# Altium schematic sheet Telemetry, I2C.SchDoc
size A; DocumentNumber: 8; SheetNumber: 8; SheetTotal: 16
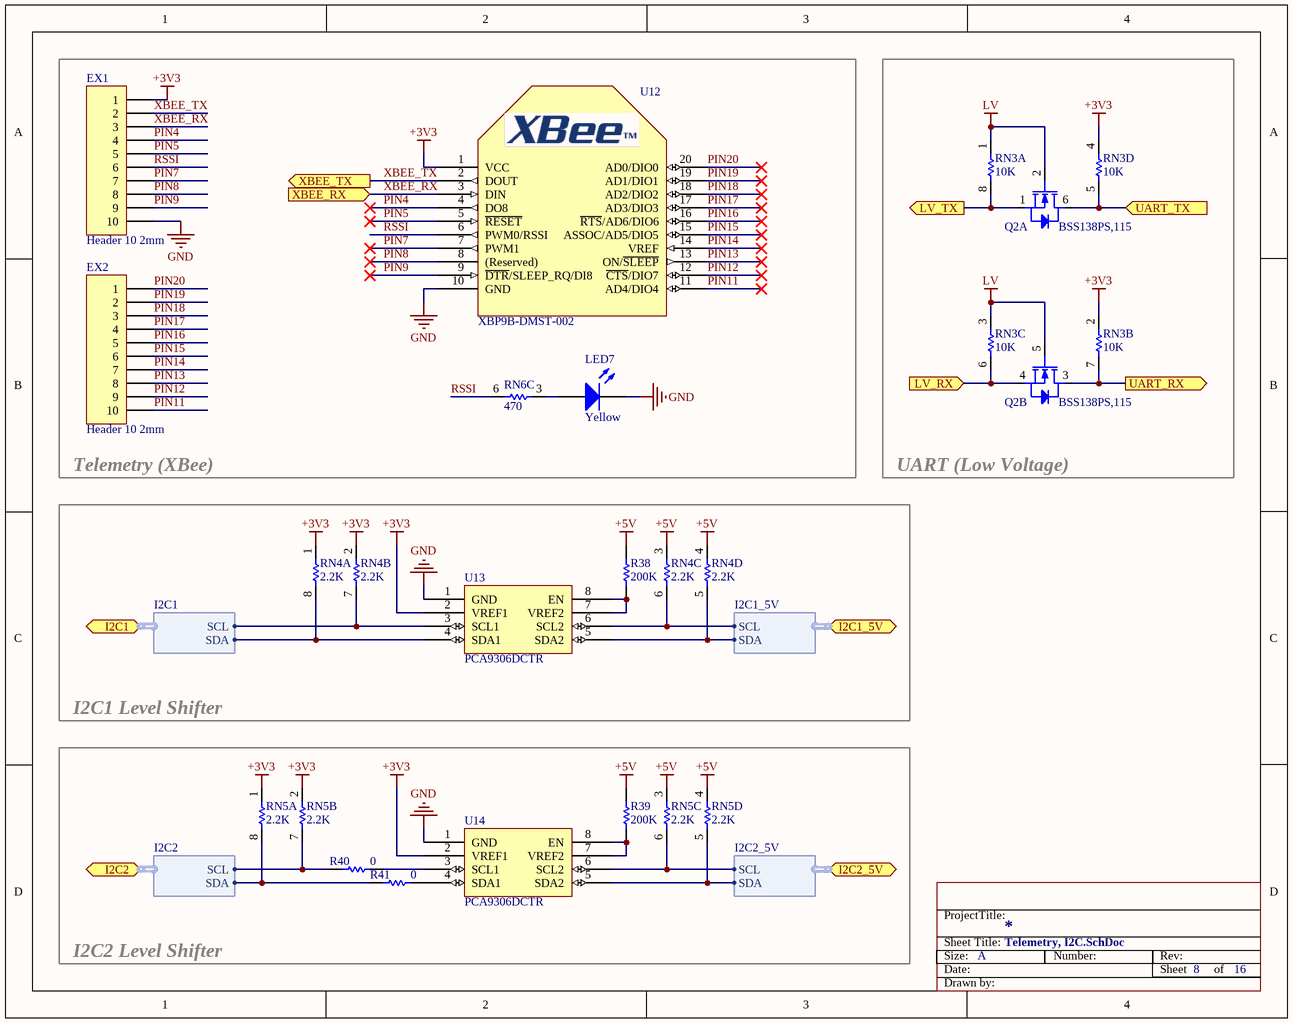
[diagram p0: Telemetry, I2C.SchDoc]

## Parts
EX1  Header 10 2mm  [2mm pitch female header]
EX2  Header 10 2mm  [2mm pitch female header]
LED7  Color: Yellow  [LED_0603[1608M]]  (hidden comment: LED)
Q2  Manufacturer Part Number: BSS138PS,115  [SOT363-6]  (hidden comment: N-CH MOSFET-D-ARRAY)  (parts A,B of 2)
R38  value 200K  [RES_0402[1005M]]  (hidden comment: RES)
R39  value 200K  [RES_0402[1005M]]  (hidden comment: RES)
R40  value 0  [JUMPER_RES_0402]  (hidden comment: RES)
R41  value 0  [JUMPER_RES_0402]  (hidden comment: RES)
RN3  value 10K  [RES ARRAY SMD]  (hidden comment: Res Network 1)  (parts A,B,C,D of 4)
RN4  value 2.2K  [RES ARRAY SMD]  (hidden comment: Res Network 1)  (parts A,B,C,D of 4)
RN5  value 2.2K  [RES ARRAY SMD]  (hidden comment: Res Network 1)  (parts A,B,C,D of 4)
RN6  value 470  [RES ARRAY SMD]  (hidden comment: Res Network 1)  (part C of 4)
U12  Manufacturer Part Number: XBP9B-DMST-002  [XBee PRO for headers]  (hidden comment: XBee / XBee PRO)
U13  Manufacturer Part Number: PCA9306DCTR  [DCT-8 (LSSOP-8)]  (hidden comment: PCA9306DC)
U14  Manufacturer Part Number: PCA9306DCTR  [DCT-8 (LSSOP-8)]  (hidden comment: PCA9306DC)

## Blocks framed on the sheet
Telemetry (XBee): EX1 EX2 LED7 RN6 U12
UART (Low Voltage): Q2 RN3
I2C1 Level Shifter: R38 RN4 U13
I2C2 Level Shifter: R39-R41 RN5 U14

## Ports
I2C1 (harness I2C1), I2C1_5V (harness I2C1_5V), I2C2 (harness I2C2), I2C2_5V (harness I2C2_5V), LV_RX (in), LV_TX (out), UART_RX (out), UART_TX (in), XBEE_RX (in), XBEE_TX (out)

## Harnesses
I2C1: SDA, SCL
I2C2: SDA, SCL
I2C1_5V: SDA, SCL
I2C2_5V: SDA, SCL

## Nets
+3V3: EX1.1 RN3.2 RN3.4 RN4.1 RN4.2 RN5.1 RN5.2 U12.1(VCC) U13.2(VREF1) U14.2(VREF1)
+5V: R38.1 R39.1 RN4.3 RN4.4 RN5.3 RN5.4
GND: EX1.10 LED7.2(K) U12.10(GND) U13.1(GND) U14.1(GND)
LV: Q2.2(G1) Q2.5(G2) RN3.1 RN3.3
LV_RX: Q2.4(S2) RN3.6 ; port LV_RX
LV_TX: Q2.1(S1) RN3.8 ; port LV_TX
PIN4: EX1.4 U12.4(DO8)
PIN5: EX1.5 U12.5(~{RESET})
PIN7: EX1.7 U12.7(PWM1)
PIN8: EX1.8 U12.8((Reserved))
PIN9: EX1.9 U12.9(~{DTR}/SLEEP_RQ/DI8)
PIN11: EX2.10 U12.11(AD4/DIO4)
PIN12: EX2.9 U12.12(~{CTS}/DIO7)
PIN13: EX2.8 U12.13(ON/~{SLEEP})
PIN14: EX2.7 U12.14(VREF)
PIN15: EX2.6 U12.15(ASSOC/AD5/DIO5)
PIN16: EX2.5 U12.16(~{RTS}/AD6/DIO6)
PIN17: EX2.4 U12.17(AD3/DIO3)
PIN18: EX2.3 U12.18(AD2/DIO2)
PIN19: EX2.2 U12.19(AD1/DIO1)
PIN20: EX2.1 U12.20(AD0/DIO0)
RSSI: EX1.6 RN6.6 U12.6(PWM0/RSSI)
UART_RX: Q2.3(D1) RN3.7 ; port UART_RX
UART_TX: Q2.6(D1) RN3.5 ; port UART_TX
XBEE_RX: EX1.3 U12.3(DIN) ; port XBEE_RX
XBEE_TX: EX1.2 U12.2(DOUT) ; port XBEE_TX
NetLED7_1: LED7.1(A) RN6.3
NetR38_2: R38.2 U13.7(VREF2) U13.8(EN)
NetR39_2: R39.2 U14.7(VREF2) U14.8(EN)
NetR40_1: R40.1 U14.3(SCL1)
NetR40_2: R40.2 RN5.7 ; port I2C2.SCL
NetR41_1: R41.1 U14.4(SDA1)
NetR41_2: R41.2 RN5.8 ; port I2C2.SDA
NetRN4_5: RN4.5 U13.5(SDA2) ; port I2C1_5V.SDA
NetRN4_6: RN4.6 U13.6(SCL2) ; port I2C1_5V.SCL
NetRN4_7: RN4.7 U13.3(SCL1) ; port I2C1.SCL
NetRN4_8: RN4.8 U13.4(SDA1) ; port I2C1.SDA
NetRN5_5: RN5.5 U14.5(SDA2) ; port I2C2_5V.SDA
NetRN5_6: RN5.6 U14.6(SCL2) ; port I2C2_5V.SCL

## Notes on the sheet
- Sheet Title:
- ProjectTitle:
- Size:
- Date:
- A
- Number:
- Rev:
- Sheet         of
- Drawn by:

## Library data of the parts
EX1 EX2 = Header 10: Header, 10-Pin; Manufacturer: Sullins Connector Solutions; Manufacturer Part Number: NPPN101BFCN-RC; ComponentLink1Description: Datasheet; ComponentLink1URL: http://www.sullinscorp.com/drawings/75_1BFC_10483.pdf; Supplier 1: Digi-Key; Supplier Part Number 1: S5751-10-ND
LED7 = LED: LED YELLOW CLEAR 0603 SMD; Manufacturer: Lite-On Inc.; Manufacturer Part Number: LTST-C190YKT; Supplier 1: Digi-Key; Supplier Part Number 1: 160-1184-1-ND; ComponentLink1URL: http://media.digikey.com/pdf/Data%20Sheets/Lite-On%20PDFs/LTST-C190YKT.pdf; ComponentLink1Description: Datasheet
Q2 = N-CH MOSFET-D-ARRAY: N-CH MOSFET W/ DIODE DUAL PACKAGE; Manufacturer: NXP Semiconductors; Vgs(th) (Max) @ Id: 1.5V @ 250µA; Current - Continuous Drain (Id) @ 25°C: 320mA; Power - Max: 420mW; Input Capacitance (Ciss) @ Vds: 50pF @ 10V; Gate Charge (Qg) @ Vgs: 0.8nC @ 4.5V; Rds On (Max) @ Id, Vgs: 1.6 Ohm @ 300mA, 10V; Drain to Source Voltage (Vdss): 60V; Supplier 1: Digi-Key; Supplier Part Number 1: 568-8393-1-ND; ComponentLink1URL: http://www.nxp.com/documents/data_sheet/BSS138PS.pdf; ComponentLink1Description: Datasheet
R38 R39 = RES: Resistor; Manufacturer: Yageo; Manufacturer Part Number: RC0402FR-07200KL; ComponentLink1URL: http://www.yageo.com/NewPortal/yageodocoutput?fileName=/pdf/R-Chip/PYu-RC_Group_51_RoHS_L_3.pdf; ComponentLink1Description: Datasheet; Supplier 1: Digi-Key; Supplier Part Number 1: 311-200KLRCT-ND
R40 R41 = RES: Resistor; Manufacturer Part Number: RC0402JR-070RL; Manufacturer: Yageo; Supplier 1: Digi-Key; Supplier Part Number 1: 311-0.0JRCT-ND; ComponentLink1URL: http://www.yageo.com/NewPortal/yageodocoutput?fileName=/pdf/R-Chip/PYu-RC_Group_51_RoHS_L_3.pdf; ComponentLink1Description: Datasheet
RN3 = Res Network 1: Isolated Resistor Network; Manufacturer Part Number: YC164-JR-0710KL; Manufacturer: Yageo; Supplier 1: Digi-Key; Supplier Part Number 1: YC164J-10KCT-ND; ComponentLink1URL: http://www.yageo.com/NewPortal/yageodocoutput?fileName=/pdf/R-Chip/PYu-YC_TC_group_51_RoHS_L_0.pdf; ComponentLink1Description: Datasheet
RN4 RN5 = Res Network 1: Isolated Resistor Network; Manufacturer Part Number: YC164-JR-072K2L; Manufacturer: Yageo; Supplier 1: Digi-Key; Supplier Part Number 1: YC164J-2.2KCT-ND; ComponentLink1URL: http://www.yageo.com/NewPortal/yageodocoutput?fileName=/pdf/R-Chip/PYu-YC_TC_group_51_RoHS_L_0.pdf; ComponentLink1Description: Datasheet
RN6 = Res Network 1: Isolated Resistor Network; Manufacturer: Yageo; Manufacturer Part Number: YC164-JR-07470RL; Supplier 1: Digi-Key; Supplier Part Number 1: YC164J-470CT-ND; ComponentLink1URL: http://www.yageo.com/NewPortal/yageodocoutput?fileName=/pdf/R-Chip/PYu-YC_TC_group_51_RoHS_L_0.pdf; ComponentLink1Description: Datasheet
U12 = XBee / XBee PRO: MODULE XBEE PRO S3B 900HP RPSMA; Manufacturer: Digi International; Current - Receiving: 29mA; Current - Transmitting: 215mA; Data Rate: 200Kbps; Modulation: FHSS; Frequency: 900MHz; Supplier 1: Digi-Key; Supplier Part Number 1: 602-1299-ND; ComponentLink1Description: Datasheet; ComponentLink1URL: https://www.google.ca/url?sa=t&rct=j&q=&esrc=s&source=web&cd=6&cad=rja&uact=8&ved=0CEYQFjAFahUKEwiKwrH8s-PIAhVNOIgKHaDJAYA&url=http%3A%2F%2Fwww.mouser.com%2Fpdfdocs%2FDigi_International_XbeePro_900HP_Datasheet.pdf&usg=AFQjCNEqRzBgr3l2kZ5UWvHUkIwjAYgYlQ
U13 U14 = PCA9306DC: IC VOLT-LEVEL TRANSLATOR SM8; Manufacturer: Texas Instruments; Supplier 1: Digi-Key; Supplier Part Number 1: 296-18509-1-ND; ComponentLink1URL: http://www.ti.com/lit/ds/symlink/pca9306.pdf; ComponentLink1Description: Datasheet